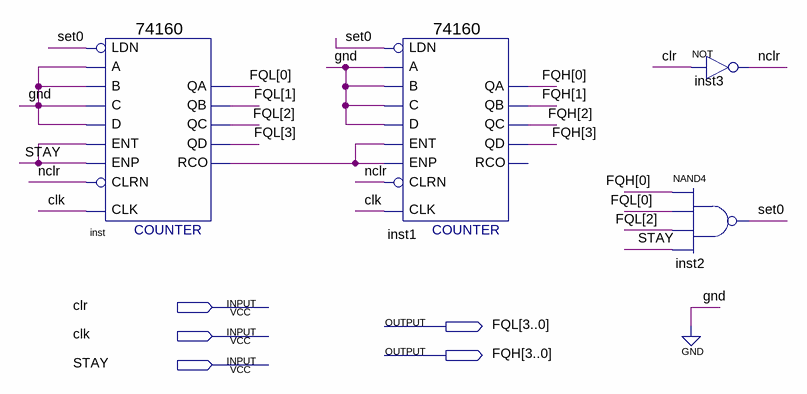
[diagram p0: schematic sheet]
// Quartus schematic count10.bdf as structural Verilog: 4 symbols, 5 pins
module count10 (
  input  clr,
  input  clk,
  input  STAY,
  output [3:0] FQL,
  output [3:0] FQH
);

  wire inst_rco, nclr, set0;

  \74160  inst (
    .CLK(clk), .ENT(STAY), .A(1'b0), .B(1'b0), .C(1'b0), .D(1'b0), .LDN(set0), .ENP(STAY), .CLRN(nclr),
    .QD(FQL[3]), .QA(FQL[0]), .QB(FQL[1]), .QC(FQL[2]), .RCO(inst_rco));
  \74160  inst1 (
    .CLK(clk), .ENT(inst_rco), .A(1'b0), .B(1'b0), .C(1'b0), .D(1'b0), .LDN(set0), .ENP(inst_rco),
    .CLRN(nclr), .QD(FQH[3]), .QA(FQH[0]), .QB(FQH[1]), .QC(FQH[2]));  // open: RCO
  not inst3 (nclr, clr);
  nand inst2 (set0, FQH[0], FQL[0], FQL[2], STAY);
endmodule
